# EAGLE design SK3000v1 - 3 (EAGLE 7.1.0)
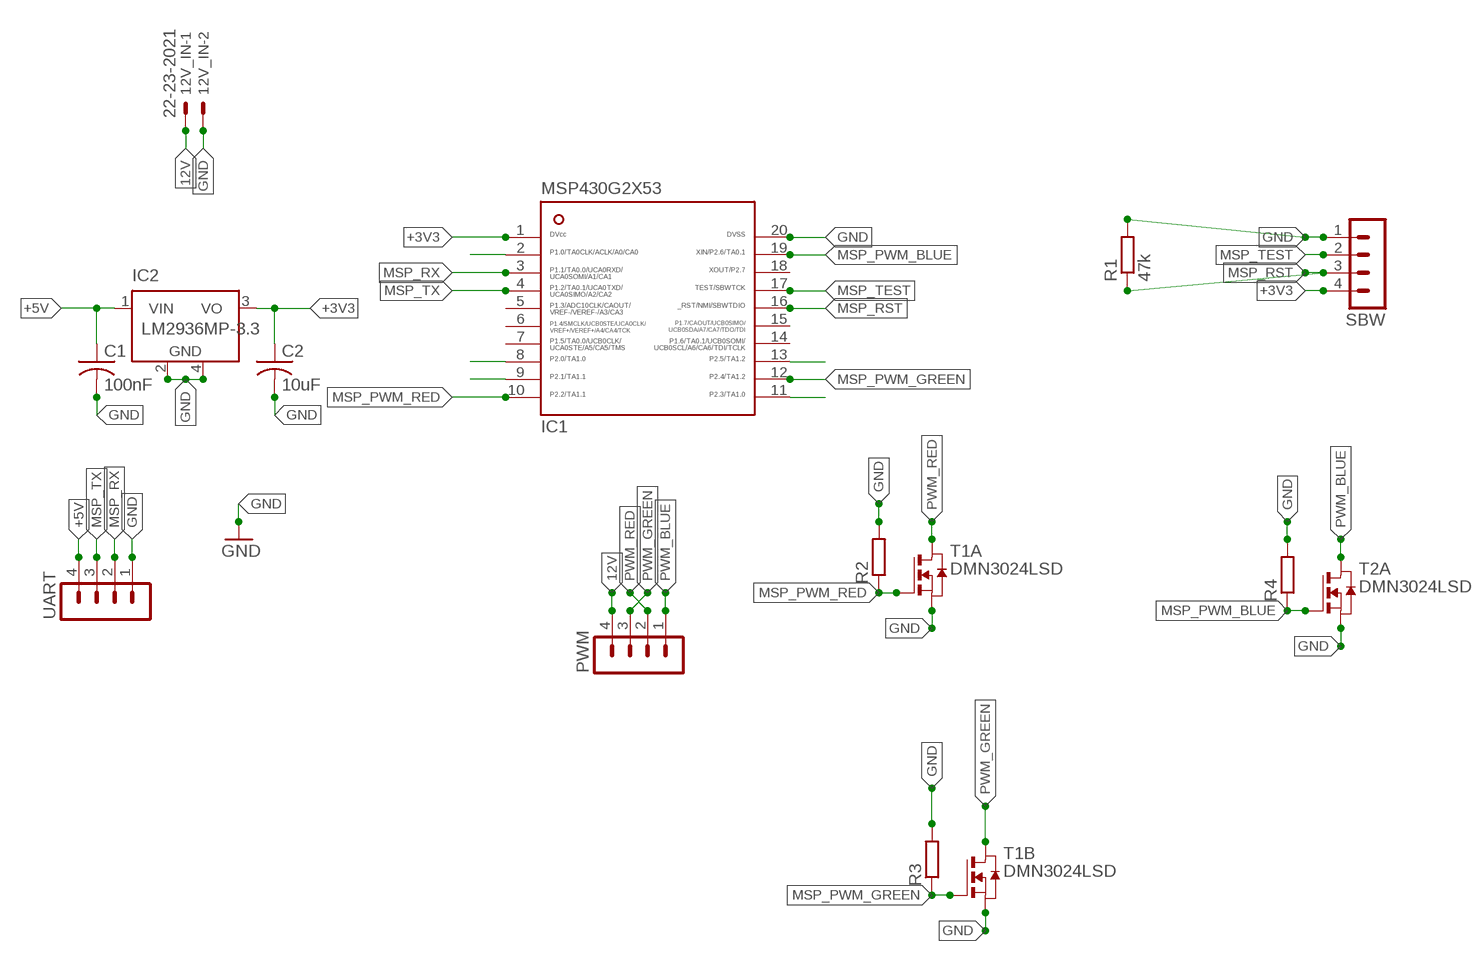
[diagram p0: schematic, sheet 1]

## Parts
12V_IN  22-23-2021  [22-23-2021]
C1  100nF  C-US025-024X044  [C025-024X044]
C2  10uF  C-US025-024X044  [C025-024X044]
IC1  MSP430G2X53-20PW20  [PW20]
IC2  LM2936MP-3.3  [SOT223]
PWM  MA04-1  [MA04-1]
R1  47k  R-EU_R0603  [R0603]
R2  R-EU_R0603  [R0603]
R3  R-EU_R0603  [R0603]
R4  R-EU_R0603  [R0603]
SBW  MA04-1  [MA04-1]
T1  DMN3024LSD  [SO8]
T2  DMN3024LSD  [SO8]
UART  MA04-1  [MA04-1]

## Nets
12V: 12V_IN.1 PWM.4
+3V3: C2.1 IC1.1 IC2.3(VO) SBW.4
+5V: C1.1 IC2.1(VIN) UART.4
GND: 12V_IN.2 C1.2 C2.2 IC1.20 IC2.2(GND) IC2.4(GND) R1.2 R2.2 R3.2 R4.2 SBW.1 T1.1(A:S) T1.3(B:S) T2.1(A:S) UART.1
MSP_PWM_BLUE: IC1.19 R4.1 T2.2(A:G)
MSP_PWM_GREEN: IC1.12 R3.1 T1.4(B:G)
MSP_PWM_RED: IC1.10 R2.1 T1.2(A:G)
MSP_RST: IC1.16 R1.1 SBW.3
MSP_RX: IC1.3 UART.2
MSP_TEST: IC1.17 SBW.2
MSP_TX: IC1.4 UART.3
N$32: IC1.2
N$33: IC1.8
N$34: IC1.9
N$36: IC1.13
N$37: IC1.11
PWM_BLUE: PWM.1 T2.7(A:D) T2.8(A:D)
PWM_GREEN: PWM.3 T1.5(B:D) T1.6(B:D)
PWM_RED: PWM.2 T1.7(A:D) T1.8(A:D)
Unconnected: IC1.5 IC1.6 IC1.7 IC1.14 IC1.15 IC1.18 T2.3(B:S) T2.4(B:G) T2.5(B:D) T2.6(B:D)

## Library data of the parts
12V_IN = con-molex:22-23-2021: .100" (2.54mm) Center Header - 2 Pin; MF: MOLEX; MPN: 22-23-2021; OC_FARNELL: 1462926; OC_NEWARK: 25C3832
C1 C2 = adafruit:C-US: CAPACITOR, American symbol
IC1 = ti_msp430:MSP430G2X53-20
IC2 = national-semiconductor:LM2936MP?*: Ultra-Low Quiescent Current LDO Voltage Regulator Source: Data sheet <http://www.national.com/ds/LM/LM2936.pdf>; MF: NATIONAL SEMICONDUCTOR; MPN: LM2936MP-3.3/NOPB; OC_FARNELL: 1469062; OC_NEWARK: 41K4523
PWM SBW UART = con-lstb:MA04-1: PIN HEADER; OC_FARNELL: unknown; OC_NEWARK: unknown
R1-R4 = rcl:R-EU_: RESISTOR, European symbol
T1 T2 = zetex:DMN3024LSD: 30V DUAL N-CHANNEL ENHANCEMENT MODE MOSFET Source: Data sheet <http://www.diodes.com/datasheets/DMN3024LSD.pdf>; OC_FARNELL: unknown; OC_NEWARK: unknown

## Board
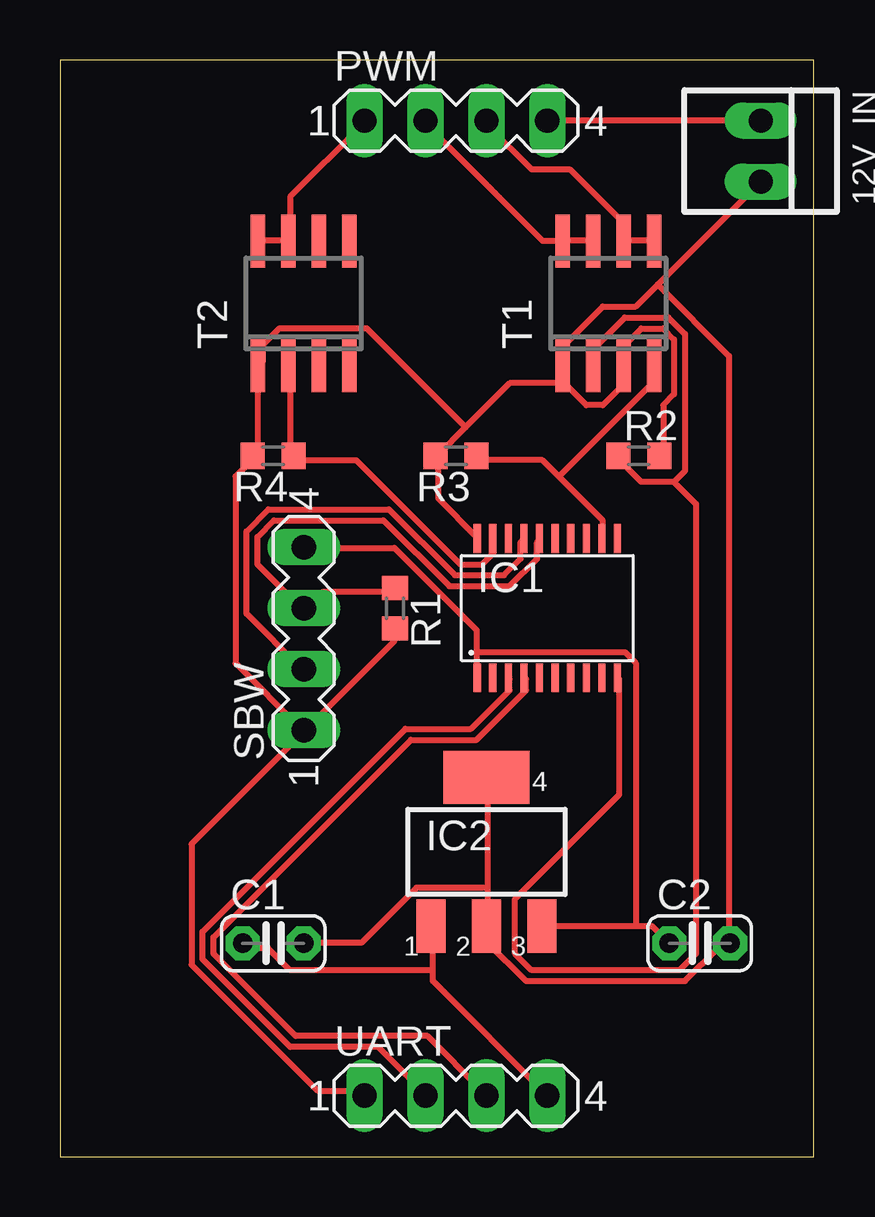
[diagram p1: board, top side]

Size 31.42 x 45.71 mm. Coordinates in mm from the lower left corner, seen from the top.
Outline: 0,0 31.42,0 31.42,45.71 0,45.71 0,0
Copper layers (1*16): Top 0.035mm / dielectric 1.5mm / Bottom 0.035mm
Design rules "default": minimum track width 10mil, minimum drill 24mil, track to track 8mil, track to pad 8mil, pad to pad 8mil, via to via 8mil, smd to smd 8mil, copper to edge 40mil, drill to drill 8mil, minimum pad ring 10mil, minimum via ring 8mil, stop-mask expansion 4mil, vias tented up to drill 0mil, thermal gap 10mil

### Footprints (pad centres in the part's own frame; a part is rotated, then mirrored left to right if it is on the bottom)
22-23-2021 = drill 1 long: 1 -1.27,0; 2 1.27,0
C025-024X044 = drill 0.813 pad 1.422 octagon: 1 -1.27,0; 2 1.27,0
PW20 = smd 0.3 x 1.2: 1 -2.925,-2.9; 2 -2.275,-2.9; 3 -1.625,-2.9; 4 -0.975,-2.9; 5 -0.325,-2.9; 6 0.325,-2.9; 7 0.975,-2.9; 8 1.625,-2.9; 9 2.275,-2.9; 10 2.925,-2.9; 11 2.925,2.9; 12 2.275,2.9; 13 1.625,2.9; 14 0.975,2.9; 15 0.325,2.9; 16 -0.325,2.9; 17 -0.975,2.9; 18 -1.625,2.9; 19 -2.275,2.9; 20 -2.925,2.9
SOT223 = smd 1.219 x 2.235: 1 -2.311,-3.099; 2 0,-3.099; 3 2.311,-3.099 | smd 3.6 x 2.2: 4 0,3.099
MA04-1 = drill 1.016 long: 1 -3.81,0; 2 -1.27,0; 3 1.27,0; 4 3.81,0
R0603 = smd 1 x 1.1: 1 -0.85,0; 2 0.85,0
SO8 = smd 0.6 x 2.2: 1 -1.905,-2.6; 2 -0.635,-2.6; 3 0.635,-2.6; 4 1.905,-2.6; 5 1.905,2.6; 6 0.635,2.6; 7 -0.635,2.6; 8 -1.905,2.6

### Placement (x,y rotation side)
12V_IN  29.21,41.91 270 top
C1  8.89,8.89 0 top
C2  26.67,8.89 0 top
IC1  MSP430G2553  [PW20]  20.32,22.86 0 top
IC2  17.78,12.7 0 top
PWM  16.51,43.18 0 top
R1  13.97,22.86 270 top
R2  24.13,29.21 0 top
R3  16.51,29.21 180 top
R4  8.89,29.21 180 top
SBW  10.16,21.59 90 top
T1  22.86,35.56 0 top
T2  10.16,35.56 0 top
UART  16.51,2.54 0 top

### Tracks (layer width: path | path; a pad name or v marks a point on that pad's centre or on a via)
12V
  Top 0.254: 12V_IN.1 29.03,43.2 20.34,43.2 PWM.4
+3V3
  Top 0.254: 24,9.6 24.69,9.6 C2.1 | 24,9.6 IC2.3 | 17.37,21.03 17.37,21.95 13.95,25.38 10.29,25.38 SBW.4 | 17.37,21.03 17.37,20.12 IC1.1 | 24,9.6 24,20.57 23.55,21.03 17.37,21.03
+5V
  Top 0.254: 15.54,7.77 15.54,7.32 UART.4 | 15.54,7.77 15.54,9.6 IC2.1 | 15.54,7.77 9.6,7.77 8.69,8.69 7.77,8.69 C1.1
GND
  Top 0.254: 17.83,11.2 17.83,15.77 IC2.4 | 17.83,11.2 17.83,9.6 | 17.83,11.2 14.86,11.2 12.57,8.91 10.29,8.91 C1.2 | 17.83,9.6 17.83,8.91 19.43,7.32 26.06,7.32 27.43,8.69 27.89,8.69 C2.2 27.89,8.91 27.89,33.38 24.92,36.35 | 17.83,9.6 IC2.2 | R1.2 13.95,21.95 13.95,21.49 10.29,17.83 SBW.1 | UART.1 12.57,2.74 10.74,2.74 5.49,8 5.49,13.03 10.06,17.6 SBW.1 | IC1.20 17.37,25.83 15.77,27.43 15.77,29.03 R3.2 15.77,29.26 16.92,30.4 | R2.2 25.15,29.26 25.15,31.32 25.6,31.77 25.6,34.06 25.15,34.52 24.23,34.52 23.55,33.83 23.55,33.15 T1.3 23.32,32.92 23.32,32 22.63,31.32 21.95,31.32 21.03,32.23 | 21.03,32.23 21.03,32.92 T1.1 | 16.92,30.4 18.75,32.23 21.03,32.23 | 21.03,32.23 T1.1 | 24.92,36.35 24,35.43 22.63,35.43 21.03,33.83 21.03,33.15 T1.1 | 24.92,36.35 12V_IN.2 | 16.92,30.4 12.8,34.52 9.14,34.52 8.46,33.83 8.46,33.15 T2.1 8.23,32.92 8.23,29.26 R4.2 8,29.03 7.32,28.35 7.32,20.57 10.06,17.83 SBW.1
MSP_PWM_BLUE
  Top 0.254: T2.2 9.6,32.92 9.6,29.26 R4.1 9.83,29.03 12.34,29.03 16.69,24.69 17.6,24.69 18.06,25.15 18.06,25.6 IC1.19
MSP_PWM_GREEN
  Top 0.254: 20.8,28.35 22.63,26.52 22.63,25.83 IC1.12 | 20.8,28.35 20.12,29.03 17.37,29.03 R3.1 | 20.8,28.35 24.69,32.23 24.69,32.92 T1.4
MSP_PWM_RED
  Top 0.254: 25.6,28.12 24.23,28.12 23.32,29.03 R2.1 | 25.6,28.12 26.06,28.57 26.06,34.29 25.38,34.98 23.55,34.98 22.4,33.83 22.4,33.15 T1.2 | 25.6,28.12 26.52,27.2 26.52,8.46 25.83,7.77 19.66,7.77 18.97,8.46 18.97,10.74 23.32,15.09 23.32,19.89 IC1.10
MSP_RST
  Top 0.254: R1.1 13.95,23.55 10.97,23.55 10.29,22.86 SBW.3 10.06,22.86 8.23,24.69 8.23,25.83 8.91,26.52 13.49,26.52 16.23,23.77 18.75,23.77 19.89,24.92 19.89,25.6 IC1.16
MSP_RX
  Top 0.254: IC1.3 18.75,19.89 18.75,19.43 17.14,17.83 14.4,17.83 5.94,9.37 5.94,8.23 9.6,4.57 13.26,4.57 15.09,2.74 UART.2
MSP_TEST
  Top 0.254: IC1.17 19.2,25.6 19.2,24.92 18.52,24.23 16.46,24.23 13.72,26.98 8.69,26.98 7.77,26.06 7.77,22.63 10.06,20.34 SBW.2
MSP_TX
  Top 0.254: IC1.4 19.43,19.89 19.43,19.43 17.37,17.37 14.63,17.37 6.4,9.14 6.4,8.46 9.83,5.03 15.32,5.03 17.6,2.74 UART.3
PWM_BLUE
  Top 0.254: T2.8 8.46,38.18 9.37,38.18 T2.7 9.6,38.18 9.6,40.01 12.57,42.98 PWM.1
PWM_GREEN
  Top 0.254: T1.5 24.69,38.18 23.55,38.18 T1.6 23.32,38.18 23.32,39.09 21.26,41.15 19.66,41.15 17.83,42.98 PWM.3
PWM_RED
  Top 0.254: T1.7 22.17,38.18 21.03,38.18 T1.8 20.8,38.18 20.12,38.18 15.32,42.98 PWM.2